# EAGLE design Minimal_ATTINY85 (EAGLE 9.6.2)
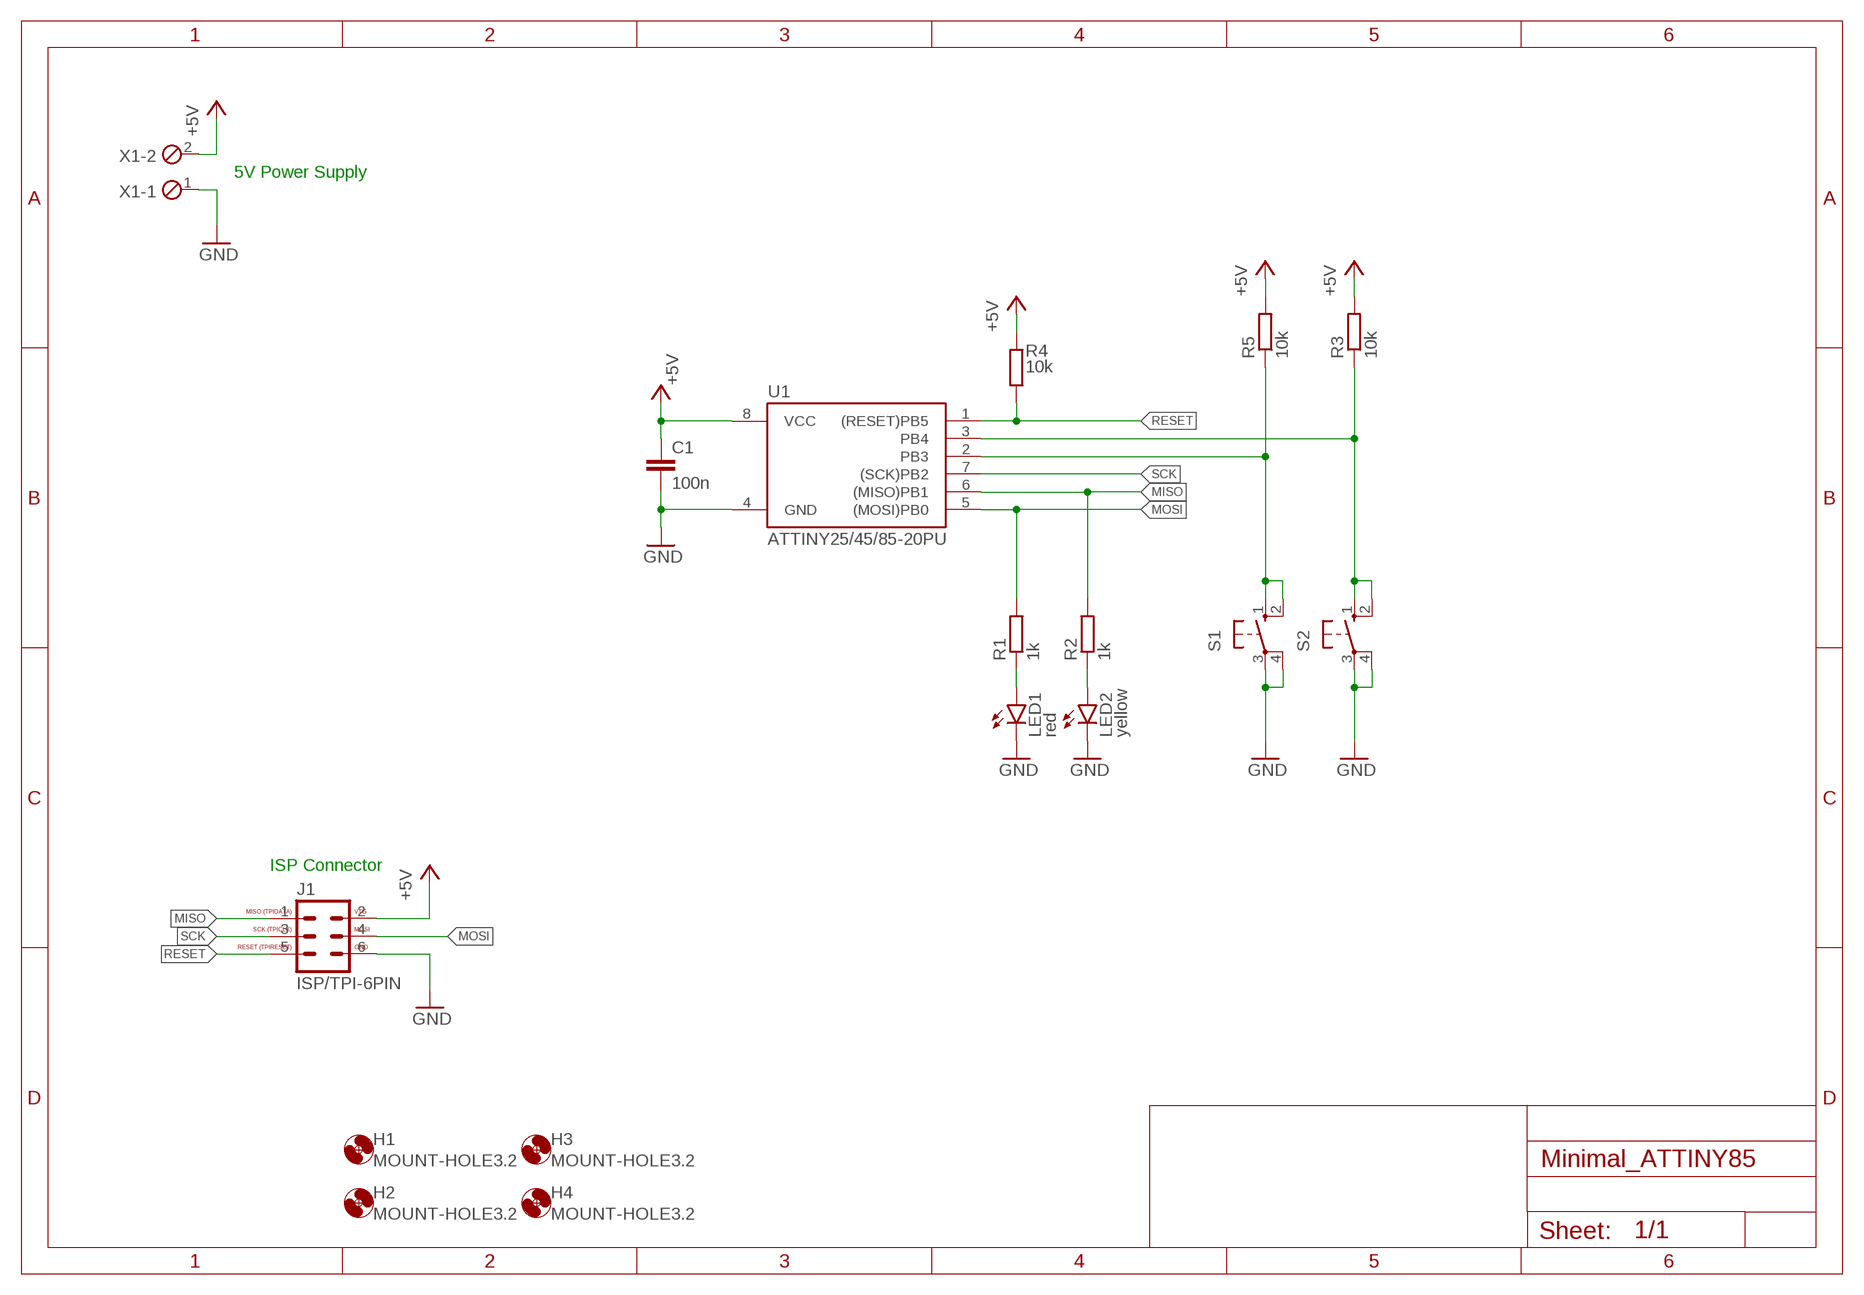
[diagram p0: schematic, sheet 1]

## Parts
C1  100n  C-EU050-024X044  [C050-024X044]
H1  MOUNT-HOLE3.2  [3,2]
H2  MOUNT-HOLE3.2  [3,2]
H3  MOUNT-HOLE3.2  [3,2]
H4  MOUNT-HOLE3.2  [3,2]
J1  ISP/TPI-6PIN  [ML6]
LED1  red  LED5MM  [LED5MM]
LED2  yellow  LED5MM  [LED5MM]
R1  1k  R-EU_0207/5V  [0207/5V]
R2  1k  R-EU_0207/5V  [0207/5V]
R3  10k  R-EU_0207/5V  [0207/5V]
R4  10k  R-EU_0207/5V  [0207/5V]
R5  10k  R-EU_0207/5V  [0207/5V]
S1  10-XX  [B3F-10XX]
S2  10-XX  [B3F-10XX]
U1  ATTINY25/45/85-20PU  [DIL08]
X1  MPT2  [2POL254]

## Nets
+5V: C1.1 J1.2 R3.2 R4.1 R5.2 U1.8(VCC) X1.2
GND: C1.2 J1.6 LED1.K(C) LED2.K(C) S1.3(P) S1.4(P1) S2.3(P) S2.4(P1) U1.4(GND) X1.1
MISO: J1.1 R2.2 U1.6((MISO)PB1)
MOSI: J1.4 R1.2 U1.5((MOSI)PB0)
N$6: LED1.A R1.1
N$7: LED2.A R2.1
N$9: R5.1 S1.1(S) S1.2(S1) U1.2(PB3)
N$10: R3.1 S2.1(S) S2.2(S1) U1.3(PB4)
RESET: J1.5 R4.2 U1.1((RESET)PB5)
SCK: J1.3 U1.7((SCK)PB2)

## Notes on the sheet
- 5V Power Supply
- ISP Connector

## Library data of the parts
C1 = rcl:C-EU: CAPACITOR, European symbol; SPICEPREFIX: C
H1-H4 = holes:MOUNT-HOLE: MOUNTING HOLE with drill center marker
J1 = Eigene-Rietig:ISP/TPI-6PIN: 6 poliger ISP/TPI-Anschluss für AVRs
LED1 LED2 = led:LED: LED OSRAM: - CHIPLED LG R971, LG N971, LY N971, LG Q971, LY Q971, LO R971, LY R971 LH N974, LH R974 LS Q976, LO Q976, LY Q976 LO Q996 - Hyper CHIPLED LW Q18S LB Q993, LB Q99A, LB R99A - SideLED LS A670, LO A670, LY A670, LG A670, LP A670 LB A673, LV A673, LT A673, LW A673 LH A674 LY A675 LS A676, LA A676, LO A676, LY A676, LW A676 LS A679, LY A679, LG A679 - Hyper Micro SIDELED® LS Y876, LA Y876, LO Y876, LY Y876 LT Y87S - SmartLED LW L88C, LW L88S LB L89C, LB L89S, LG L890 LS L89K, LO L89K, LY L89K LS L896, LA L896, LO L896, LY L896 - TOPLED LS T670, LO T670, LY T670, LG T670, LP T670 LSG T670, LSP T670, LSY T670, LOP T670, LYG T670 LG T671, LOG T671, LSG T671 LB T673, LV T673, LT T673, LW T673 LH T674 LS T676, LA T676, LO T676, LY T676, LB T676, LH T676, LSB T676, LW T676 LB T67C, LV T67C, LT T67C, LS T67K, LO T67K, LY T67K, LW E67C LS E67B, LA E67B, LO E67B, LY E67B, LB E67C, LV E67C, LT E67C LW T67C LS T679, LY T679, LG T679 LS T770, LO T770, LY T770, LG T770, LP T770 LB T773, LV T773, LT T773, LW T773 LH T774 LS E675, LA E675, LY E675, LS T675 LS T776, LA T776, LO T776, LY T776, LB T776 LHGB T686 LT T68C, LB T68C - Hyper Mini TOPLED® LB M676 - Mini TOPLED Santana® LG M470 LS M47K, LO M47K, LY M47K Source: http://www.osram.convergy.de LUXEON: - LUMILED® LXK2-PW12-R00, LXK2-PW12-S00, LXK2-PW14-U00, LXK2-PW14-V00 LXK2-PM12-R00, LXK2-PM12-S00, LXK2-PM14-U00 LXK2-PE12-Q00, LXK2-PE12-R00, LXK2-PE12-S00, LXK2-PE14-T00, LXK2-PE14-U00 LXK2-PB12-K00, LXK2-PB12-L00, LXK2-PB12-M00, LXK2-PB14-N00, LXK2-PB14-P00, LXK2-PB14-Q00 LXK2-PR12-L00, LXK2-PR12-M00, LXK2-PR14-Q00, LXK2-PR14-R00 LXK2-PD12-Q00, LXK2-PD12-R00, LXK2-PD12-S00 LXK2-PH12-R00, LXK2-PH12-S00 LXK2-PL12-P00, LXK2-PL12-Q00, LXK2-PL12-R00 Source: www.luxeon.com KINGBRIGHT: KA-3528ASYC Source: www.kingbright.com
R1-R5 = rcl:R-EU_: RESISTOR, European symbol; SPICEPREFIX: R
S1 S2 = switch-omron:10-XX: OMRON SWITCH; MPN: B3F-1000; OC_FARNELL: 176432; OC_NEWARK: 36M3542
U1 = Eigene-Rietig:ATTINY25/45/85
X1 = con-phoenix-254:MPT2: PHOENIX CONNECTOR; OC_FARNELL: unknown; OC_NEWARK: unknown

## Board
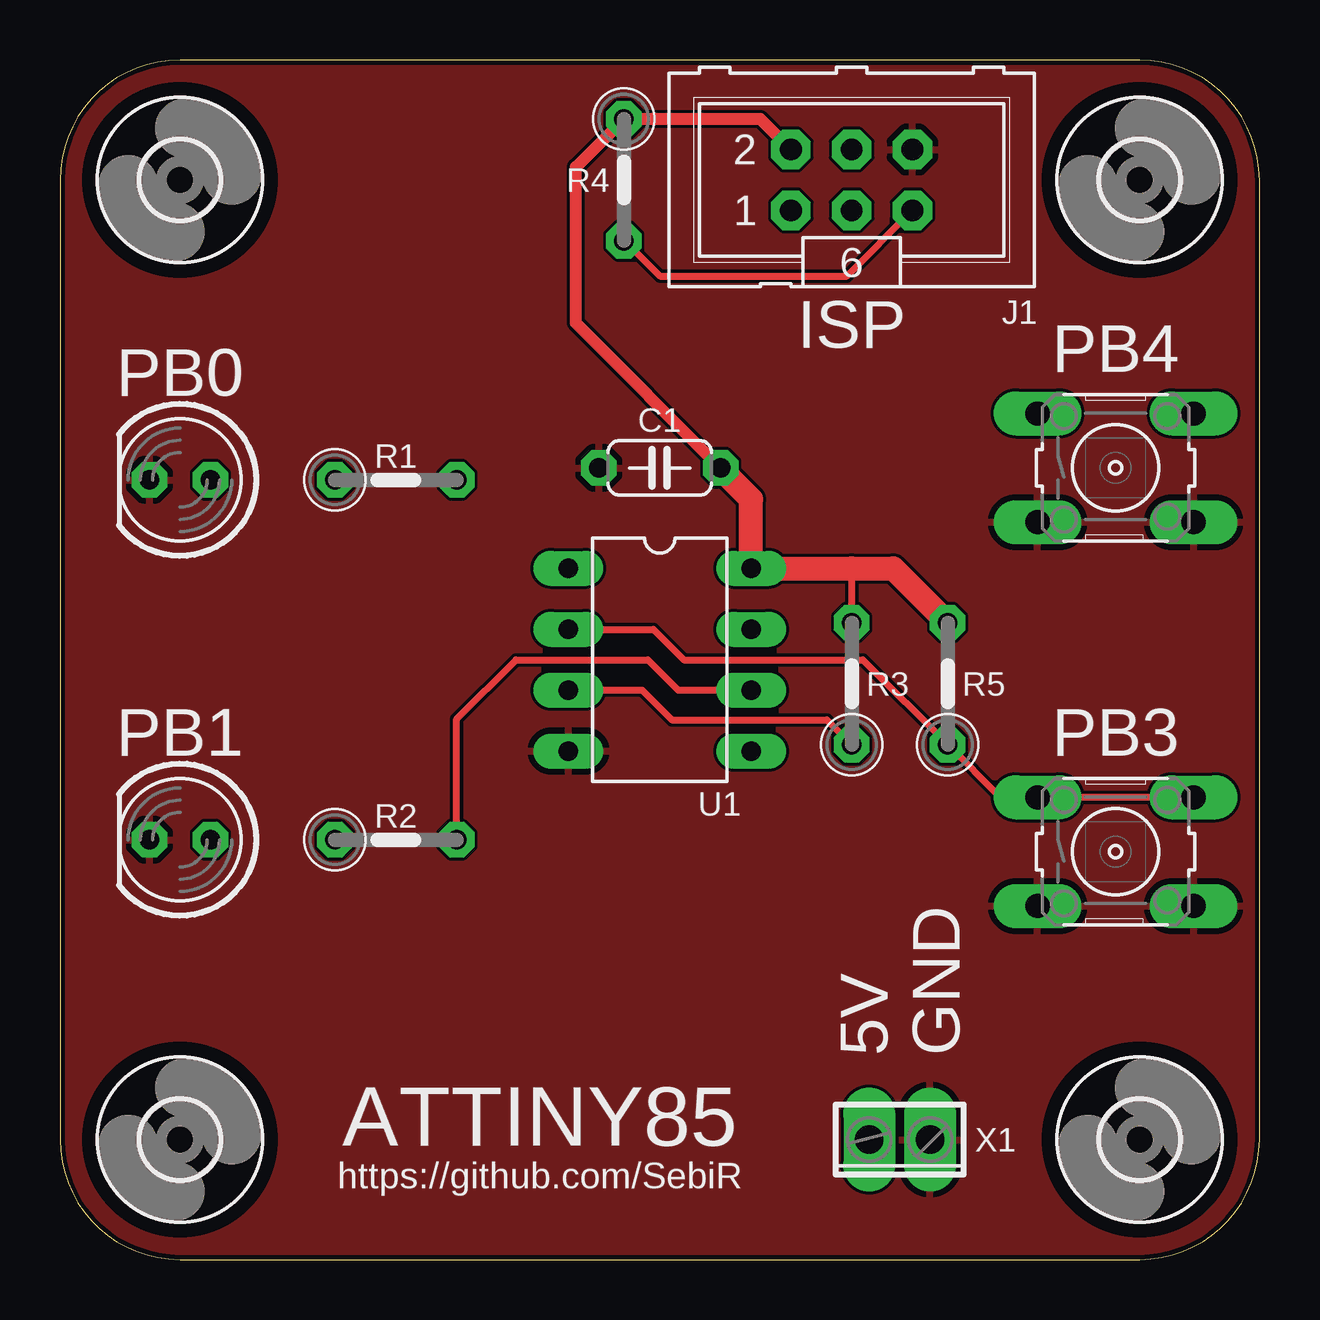
[diagram p1: board, top side]
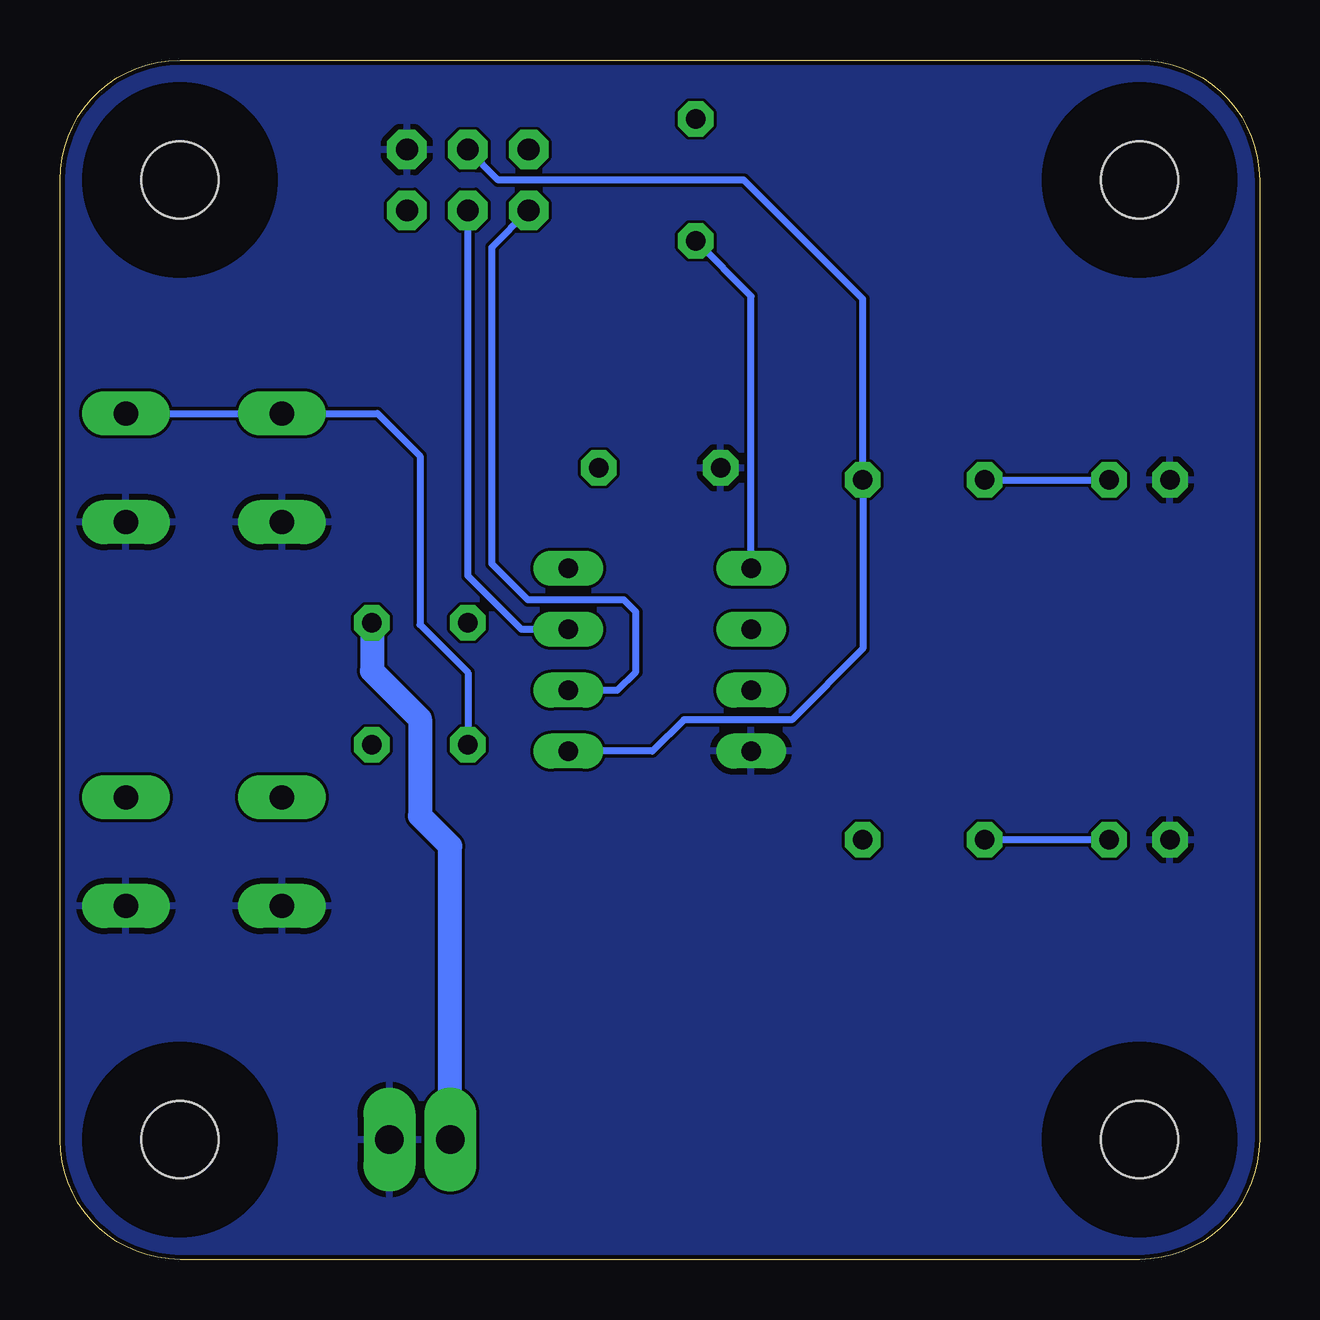
[diagram p2: board, bottom side, seen from below]

Size 50 x 50 mm. Coordinates in mm from the lower left corner, seen from the top.
Outline: 5,0 45,0 arc90 50,5 50,45 arc90 45,50 5,50 arc90 0,45 0,5 arc90 5,0
Copper layers (1*16): Top 0.035mm / dielectric 1.6mm / Bottom 0.035mm
Design rules "jlcpcb-2layers": minimum track width 0.2mm, minimum drill 0.3mm, track to track 5mil, track to pad 5mil, pad to pad 5mil, via to via 5mil, smd to smd 5mil, copper to edge 0.2mm, drill to drill 6mil, minimum pad ring 10mil, minimum via ring 0.125mm, stop-mask expansion 4mil, vias tented up to drill 0.5mm, thermal gap 10mil

### Footprints (pad centres in the part's own frame; a part is rotated, then mirrored left to right if it is on the bottom)
C050-024X044 = drill 0.813 octagon: 1 -2.54,0; 2 2.54,0
3,2 = hole 3.2: 0,0
ML6 = drill 0.914 octagon: 1 -2.54,-1.27; 2 -2.54,1.27; 3 0,-1.27; 4 0,1.27; 5 2.54,-1.27; 6 2.54,1.27
LED5MM = drill 0.813 octagon: A -1.27,0; K 1.27,0
0207/5V = drill 0.813 octagon: 1 -2.54,0; 2 2.54,0
B3F-10XX = drill 1.016 long: 1 -3.251,2.261; 2 3.251,2.261; 3 -3.251,-2.261; 4 3.251,-2.261
DIL08 = drill 0.813 long: 1 -3.81,-3.81; 2 -1.27,-3.81; 3 1.27,-3.81; 4 3.81,-3.81; 5 3.81,3.81; 6 1.27,3.81; 7 -1.27,3.81; 8 -3.81,3.81
2POL254 = drill 1.2 long: 1 -1.27,0; 2 1.27,0

### Placement (x,y rotation side)
C1  25,33 180 top
H1  5,5 0 top
H2  45,5 0 top
H3  5,45 0 top
H4  45,45 0 top
J1  33,45 0 top
LED1  5,32.5 180 top
LED2  5,17.5 180 top
R1  14,32.5 0 top
R2  14,17.5 0 top
R3  33,24 90 top
R4  23.5,45 270 top
R5  37,24 90 top
S1  44,17 0 top
S2  44,33 0 top
U1  25,25 270 top
X1  35,5 180 top

### Tracks (layer width: path | path; a pad name or v marks a point on that pad's centre or on a via)
+5V
  Top 0.3: R3.2 33,28.81
  Top 0.5: J1.2 29.19,47.54 R4.1 21.5,45.54 21.5,39.04 C1.1
  Top 1: C1.1 27.54,32.96 28.81,31.69 U1.8 33,28.81 34.73,28.81 R5.2
  Bottom 1: R5.2 37,24.54 35,22.54 35,18.5 33.73,17.23 X1.2
GND
  pour Bottom: 50,45 50,5 arc-90 45,0 5,0 arc-90 0,5 0,45 arc-90 5,50 45,50 arc-90
  pour Top: 50,5 50,45 arc90 45,50 5,50 arc90 0,45 0,5 arc90 5,0 45,0 arc90
MISO
  Top 0.3: R2.2 16.54,22.54 19,25 24.5,25 25.77,23.73 U1.6
  Bottom 0.3: U1.6 26.77,23.73 26,24.5 26,27 26.5,27.5 30.5,27.5 32,29 32,42.19 J1.1
MOSI
  Bottom 0.3: U1.5 25.31,21.19 24,22.5 19.5,22.5 16.54,25.46 R1.2 16.54,40.04 21.5,45 31.73,45 J1.4
N$6
  Bottom 0.3: R1.1 LED1.A
N$7
  Bottom 0.3: LED2.A R2.1
N$9
  Top 0.3: S1.2 S1.1 39.2,19.26 R5.1 33.46,25 26,25 24.73,26.27 U1.2
N$10
  Top 0.3: R3.1 31.96,22.5 25.5,22.5 24.27,23.73 U1.3
  Bottom 0.3: S2.2 S2.1 36.76,35.26 35,33.5 35,26.46 33,24.46 R3.1
RESET
  Top 0.3: R4.2 23.54,42.46 25,41 32.81,41 J1.5
  Bottom 0.3: R4.2 21.19,40.15 U1.1
SCK
  Bottom 0.3: U1.7 30.77,26.27 33,28.5 J1.3

### Text on the board
tPlace: ISP | PB4 | PB0 | PB1 | PB3 | 5V | GND | ATTINY85 | https://github.com/SebiR